# Altium schematic sheet 01_Power.SchDoc
size A4
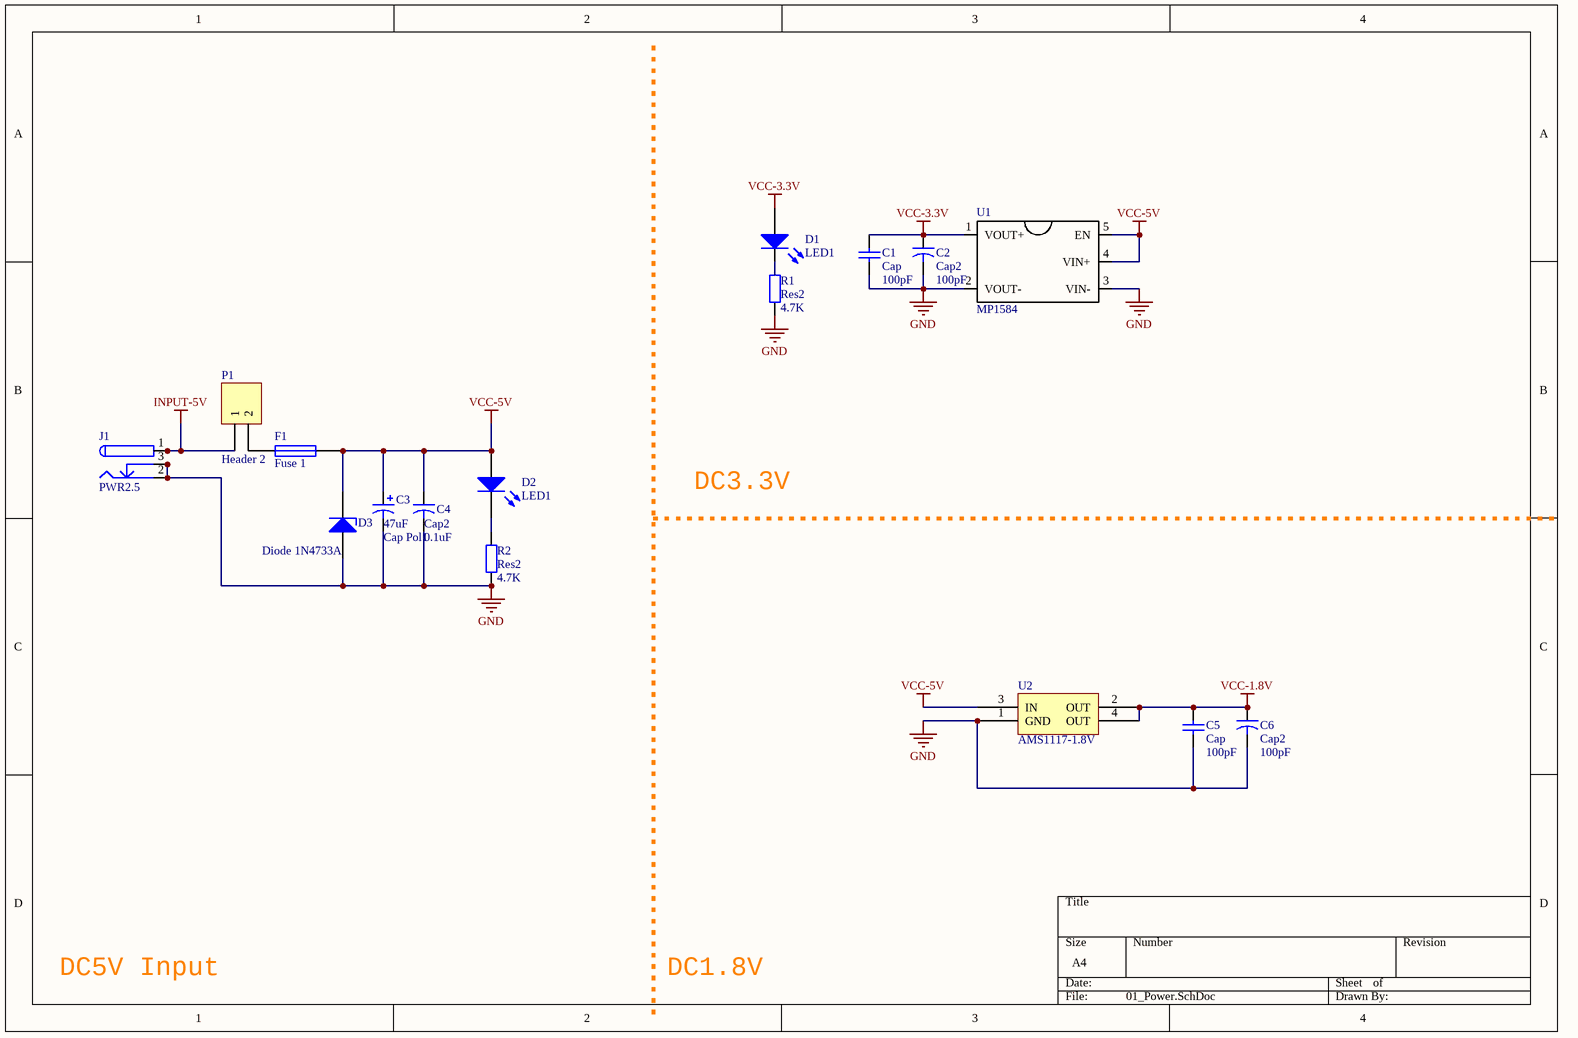
[diagram p0: 01_Power.SchDoc]

## Parts
C1  Cap  value 100pF  [RAD-0.1]
C2  Cap2  value 100pF  [CAPR5-4X5]
C3  Cap Pol1  value 47uF  [RB2.5-6.3]
C4  Cap2  value 0.1uF  [CAPR5-4X5]
C5  Cap  value 100pF  [RAD-0.1]
C6  Cap2  value 100pF  [CAPR5-4X5]
D1  LED1  [LED-R3.0]
D2  LED1  [LED-R3.0]
D3  Diode 1N4733A  [DO-35]
F1  Fuse 1  [PIN-W2/E2.8]
J1  PWR2.5  [KLD-0202]
P1  Header 2  [HDR1X2]
R1  Res2  value 4.7K  [AXIAL-0.4]
R2  Res2  value 4.7K  [AXIAL-0.4]
U1  MP1584  [MP1584]
U2  AMS1117-1.8V  [SOT223-4M]

## Nets
GND: C1.1 C2.2 C3.2 C4.2 C5.1 C6.2 D3.1(A) J1.2 J1.2A J1.2B J1.3 J1.3A J1.3B R1.1 R2.1 U1.2(VOUT-) U1.3(VIN-) U2.1(GND)
INPUT-5V: J1.1 J1.1A J1.1B P1.1
VCC-1.8V: C5.2 C6.1 U2.2(OUT) U2.4(OUT)
VCC-3.3V: C1.2 C2.1 D1.1(A) U1.1(VOUT+)
VCC-5V: C3.1 C4.1 D2.1(A) D3.2(K) F1.2 U1.4(VIN+) U1.5(EN) U2.3(IN)
NetD1_2: D1.2(K) R1.2
NetD2_2: D2.2(K) R2.2
NetF1_1: F1.1 P1.2

## Notes on the sheet
- DC3.3V Output
- DC5V Input
- DC1.8V Output

## Library data of the parts
C1 C5 = Cap: Capacitor; Published: 8-Jun-2000; LatestRevisionDate: 17-Jul-2002; LatestRevisionNote: Re-released for DXP Platform.; PackageReference: RAD-0.3; Publisher: Altium Limited; PackageDescription: Radial Cap, Thru-Hole; 2 Leads; 0.3 in Pin Spacing
C2 C4 C6 = Cap2: Capacitor; Published: 23-Sep-2002; PackageReference: CAPR5-4X5; Publisher: Altium Limited; PackageDescription: Capacitor; 2 Leads
C3 = Cap Pol1: Polarized Capacitor (Radial); Published: 8-Jun-2000; LatestRevisionDate: 17-Jul-2002; LatestRevisionNote: Re-released for DXP Platform.; PackageReference: RB7.6-15; Publisher: Altium Limited; PackageDescription: Polarized Capacitor (Radial); 2 Leads
D1 D2 = LED1: Typical RED GaAs LED; Published: 8-Jun-2000; LatestRevisionDate: 08-Jul-2005; LatestRevisionNote: Mech Layer 1 removed.; PackageReference: LED-1; Publisher: Altium Limited; PackageDescription: LED; 2 Leads
D3 = Diode 1N4733A: DIODE ZENER 5.1V 1W DO41; Manufacturer: Diodes; Manufacturer Part Number: 1N4733A-T; Voltage Tolerance: 5 %; Voltage Temperature Coefficient: 0.015 %/C; Zz - Zener Impedance: 7 Ohms; Configuration: Single; Brand: Diodes Incorporated; Ir - Reverse Current: 10 uA; Unit Weight: 0.010582 oz; Published: 8-Jun-2000; LatestRevisionDate: 17-Jul-2002; LatestRevisionNote: Re-released for DXP Platform.; DatasheetVersion: 1997; PackageReference: DO-35; Publisher: Altium Limited; PackageDescription: Diode, Axial; Body 3.8 x 1.9 mm (LxDia. max), Lead Dia. 0.53 mm (max); Code_JEDEC: DO-204-AH; ComponentLink1Description: Manufacturer Link; ComponentLink1URL: http://www.fairchildsemi.com/; ComponentLink2Description: Datasheet; ComponentLink2URL: http://www.fairchildsemi.com/ds/1N%2F1N4448.pdf; Supplier 1: Digikey; Stock 1: 0; Pricing 1: 1=0.43, 10=0.306, 25=0.238, 100=0.1802, 250=0.1274, 500=0.102, 1000=0.0782, 2500=0.068 (USD); Product Category: Zener Diodes; RoHS: True; Vz - Zener Voltage: 5.1 V; Mounting Style: Through Hole; Package / Case: DO-41; Pd - Power Dissipation: 1 W; Maximum Operating Temperature: + 175 C; Packaging: Reel; Height: 2.71 mm; Length: 4.7 mm; Minimum Operating Temperature: - 65 C; Series: 1N47; Factory Pack Quantity: 5000; Width: 2.71 mm; &lt;PCN&gt;: http://www.mouser.com/PCN/Diodes_Inc_2126.pdf; ComponentLink3URL: https://datasheet.ciiva.com/25927/ds18007-25927157.pdf; ComponentLink3Description: https://datasheet.ciiva.com/25927/ds18007-25927157.pdf; ComponentLink4URL: https://datasheet.ciiva.com/10639/ds18007-10639654.pdf; ComponentLink4Description: https://datasheet.ciiva.com/10639/ds18007-10639654.pdf; ComponentLink5URL: https://datasheet.ciiva.com/8346/ds18007-8346231.pdf; ComponentLink5Description: https://datasheet.ciiva.com/8346/ds18007-8346231.pdf; ComponentLink6URL: https://datasheet.ciiva.com/892/ds18007-892024.pdf; ComponentLink6Description: https://datasheet.ciiva.com/892/ds18007-892024.pdf; ComponentLink7URL: https://datasheet.ciiva.com/892/ds18007-892025.pdf; ComponentLink7Description: https://datasheet.ciiva.com/892/ds18007-892025.pdf; ComponentLink8URL: https://datasheet.ciiva.com/15219/getdatasheetpartid-295066-15219562.pdf; ComponentLink8Description: https://datasheet.ciiva.com/15219/getdatasheetpartid-295066-15219562.pdf; ComponentLink9URL: https://datasheet.ciiva.com/34302/1538030-34302347.pdf; ComponentLink9Description: https://datasheet.ciiva.com/34302/1538030-34302347.pdf; ComponentLink10URL: https://datasheet.ciiva.com/16203/ds18007-16203966.pdf; ComponentLink10Description: https://datasheet.ciiva.com/16203/ds18007-16203966.pdf
F1 = Fuse 1: Fuse; Published: 8-Jun-2000; LatestRevisionDate: 17-Jul-2002; LatestRevisionNote: Re-released for DXP Platform.; PackageReference: PIN-W2/E2.8; Publisher: Altium Limited; PackageDescription: Thru-Hole; 2 Leads
J1 = PWR2.5: Low Voltage Power Supply Connector; Published: 17-Dec-2003; DatasheetDocument: 09-May-2002; Publisher: Altium Limited; ComponentLink1Description: Manufacturer Link; ComponentLink1URL: http://domino.kycon.com/internet/Products.html
P1 = Header 2: Header, 2-Pin; LatestRevisionDate: 17-Jul-2002; LatestRevisionNote: Re-released for DXP Platform.; Publisher: Altium Limited
R1 R2 = Res2: Resistor; Published: 8-Jun-2000; LatestRevisionDate: 17-Jul-2002; LatestRevisionNote: Re-released for DXP Platform.; PackageReference: AXIAL-0.4; Publisher: Altium Limited; PackageDescription: Axial Device, Thru-Hole; 2 Leads; 0.4 in Pin Spacing
U1 = MP1584: 3.3V Voltage Regulators - Switching Regulators 3A 1.5MHz 28V Nonsync Buck; Manufacturer: Monolithic Power Systems (MPS); Manufacturer Part Number: MP1584EN-LF; Input Voltage: 4.5 V; Operating Supply Voltage: 4.5 V to 28 V; Number of Outputs: 1 Output; Supplier 1: Digikey; Stock 1: 0; Pricing 1: 100=2.1525 (USD); Operating Temperature Range: - 20 C to + 85 C; Product Category: Voltage Regulators - Switching Regulators; RoHS: Details; Topology: Buck; Input Voltage MAX: 28 V; Switching Frequency: 1.5 MHz; Output Voltage: 3.3 V; Output Current: 3 A; Mounting Style: SMD/SMT; Package / Case: SOIC-8; Brand: Monolithic Power Systems (MPS); Packaging: Tube; Series: MP1584EN; Factory Pack Quantity: 100; ComponentLink1URL: http://www.monolithicpower.com/Lists/Product_NonSynchronous%20Switcher_5727/DispForm.aspx?ID=77; ComponentLink1Description: http://www.monolithicpower.com/Lists/Product_NonSynchronous%20Switcher_5727/DispForm.aspx?ID=77
U2 = AMS1117: AM1117; Manufacturer: STMicroelectronics; Manufacturer Part Number: LD1117S-12TR; Input Voltage Min: 1.4V; Input Voltage Max: 15V; Output Voltage Nom.: 1.2V; Output Current: 800mA; Dropout Voltage Vdo: 1.1V; LDO Regulator Case Style: SOT-223; No. of Pins: 3Pins; Product Range: LD1117 Series; SVHC: No SVHC (17-Dec-2015); Supplier 1: Digikey; Stock 1: 2500; Pricing 1: 2500=0.155, 5000=0.145, 12500=0.135, 25000=0.128, 62500=0.125 (USD); Operating Temperature Min: 0°C; Operating Temperature Max: 125°C; Packaging: Cut Tape; MSL: MSL 1 - Unlimited; ComponentLink1URL: https://datasheet.ciiva.com/1511/1776449-1511569.pdf; ComponentLink1Description: https://datasheet.ciiva.com/1511/1776449-1511569.pdf; ComponentLink2URL: https://datasheet.ciiva.com/2053/cd00000544-2053511.pdf; ComponentLink2Description: https://datasheet.ciiva.com/2053/cd00000544-2053511.pdf; ComponentLink3URL: https://datasheet.ciiva.com/2053/cd00000544-2053512.pdf; ComponentLink3Description: https://datasheet.ciiva.com/2053/cd00000544-2053512.pdf; ComponentLink4URL: https://datasheet.ciiva.com/2053/cd00000544-2053513.pdf; ComponentLink4Description: https://datasheet.ciiva.com/2053/cd00000544-2053513.pdf; ComponentLink5URL: https://datasheet.ciiva.com/29696/1390207-29696618.pdf; ComponentLink5Description: https://datasheet.ciiva.com/29696/1390207-29696618.pdf; ComponentLink6URL: https://datasheet.ciiva.com/7992/1776449-7992619.pdf; ComponentLink6Description: https://datasheet.ciiva.com/7992/1776449-7992619.pdf; ComponentLink7URL: https://datasheet.ciiva.com/41440/001185296-da-01-en-ic-reg-ldo-1-2v-ld1117s12tr-sot-223-stm-41440310.pdf; ComponentLink7Description: https://datasheet.ciiva.com/41440/001185296-da-01-en-ic-reg-ldo-1-2v-ld1117s12tr-sot-223-stm-41440310.pdf